# EAGLE schematic TempPCB_v18 (EAGLE 9.7.0)
COMPANY: ADAFRUIT INDUSTRIES; DRAWN: KTOWN; REV: A
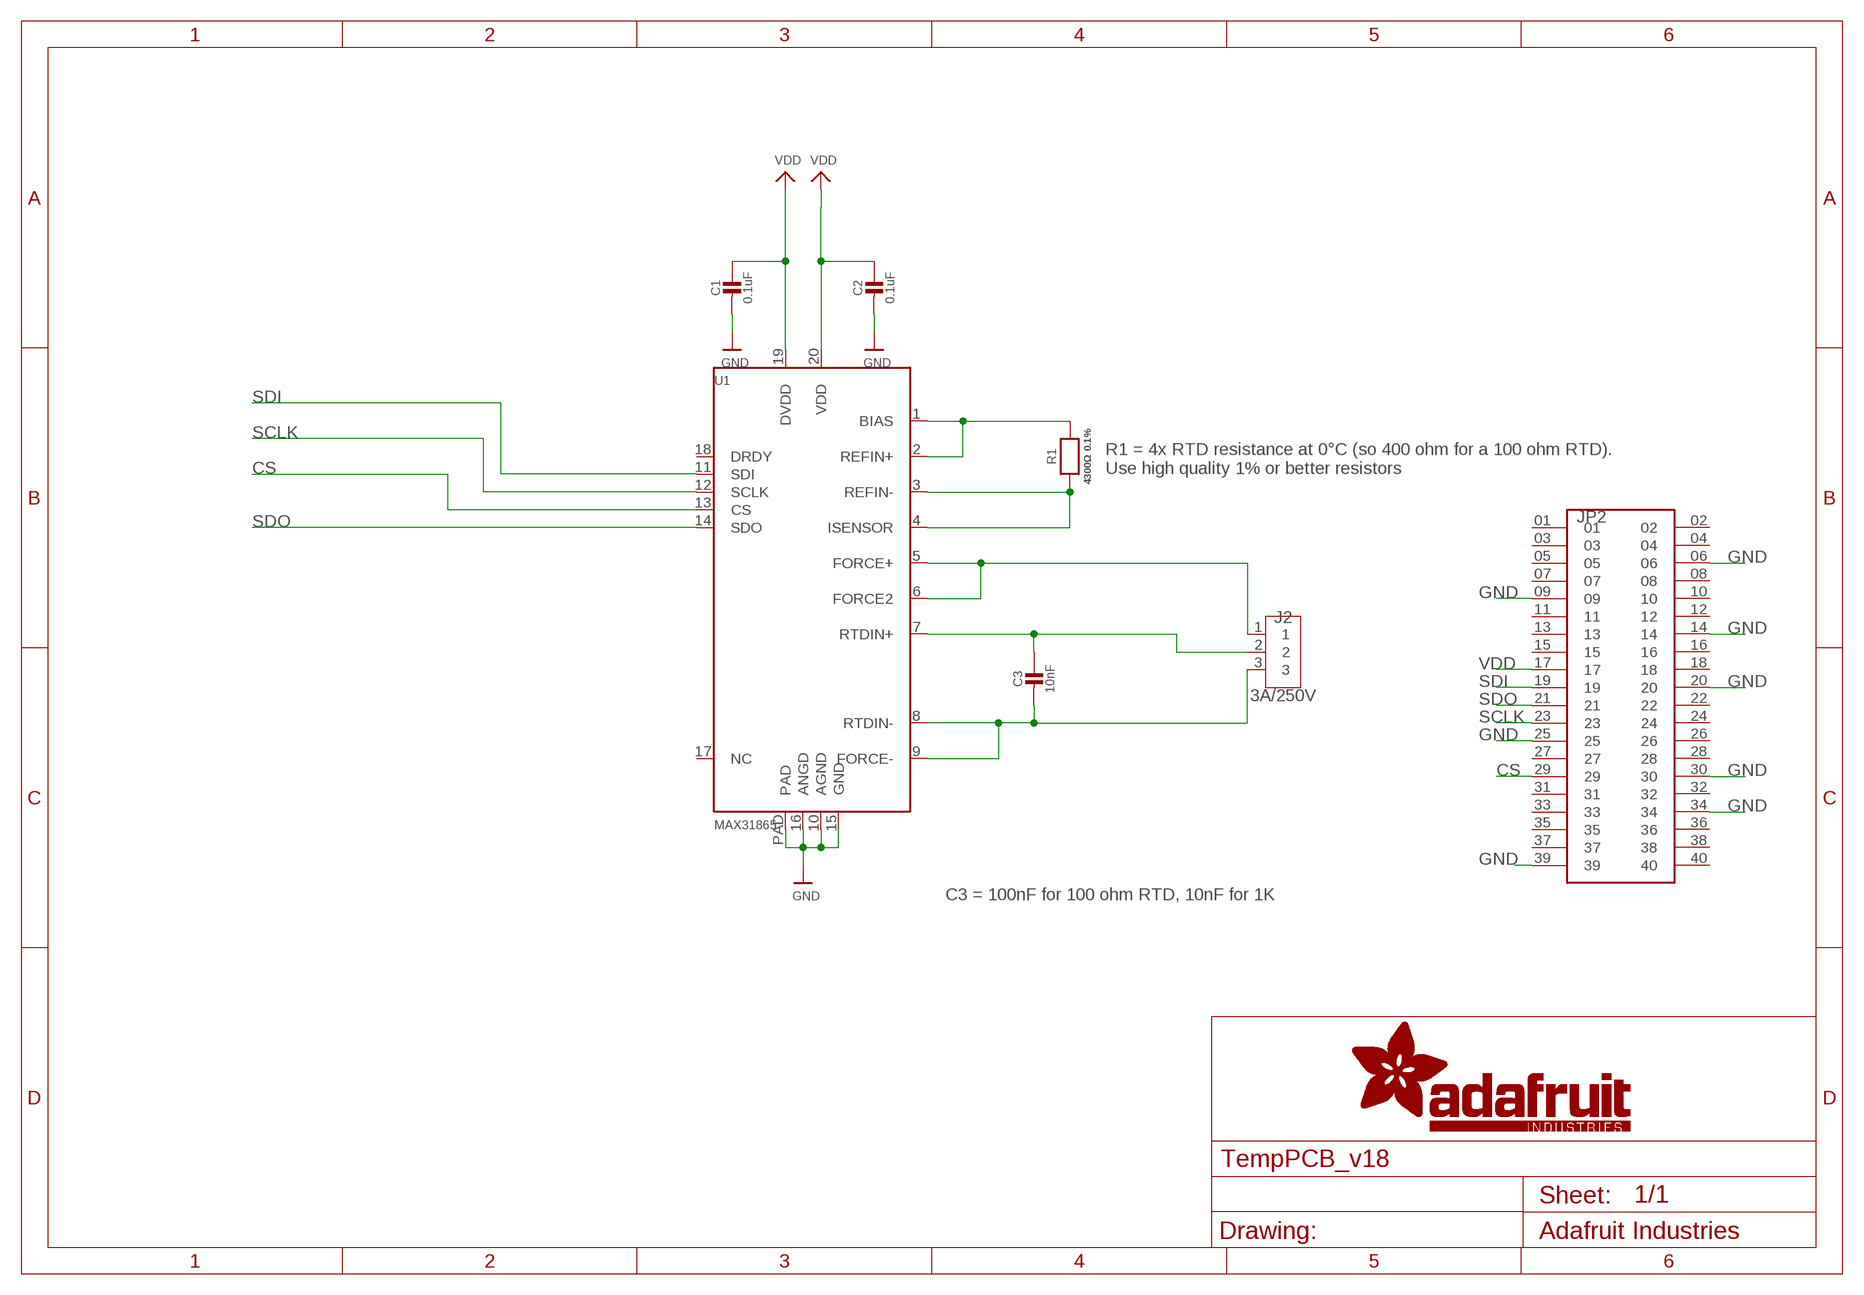
[diagram p0: schematic, sheet 1]

## Parts
C1  0.1uF  CAP_CERAMIC0805-NOOUTLINE  [0805-NO]
C2  0.1uF  CAP_CERAMIC0805-NOOUTLINE  [0805-NO]
C3  10nF  CAP_CERAMIC0805-NOOUTLINE  [0805-NO]
J2  3A/250V  S3B-XH-A  [S3B-XH-A]
JP2  SSQ-120-03-T-D  [SAMTEC_SSQ-120-03-T-D]
R1  4300Ω 0.1%  RESISTOR0805_NOOUTLINE  [0805-NO]
U1  MAX31865  TEMP_MAX31865  [QFN20_4MM_0.65MM]

## Nets
CS: JP2.29 U1.13(CS)
FORCE+: J2.1 U1.5(FORCE+) U1.6(FORCE2)
GND: C1.2 C2.2 JP2.06 JP2.09 JP2.14 JP2.20 JP2.25 JP2.30 JP2.34 JP2.39 U1.10(AGND) U1.15(GND) U1.16(ANGD) U1.PAD
N$1: R1.1 U1.3(REFIN-) U1.4(ISENSOR)
N$2: R1.2 U1.1(BIAS) U1.2(REFIN+)
RTDIN+: C3.1 J2.2 U1.7(RTDIN+)
RTDIN-: C3.2 J2.3 U1.8(RTDIN-) U1.9(FORCE-)
SCLK: JP2.23 U1.12(SCLK)
SDI: JP2.19 U1.11(SDI)
SDO: JP2.21 U1.14(SDO)
VDD: C1.1 C2.1 JP2.17 U1.19(DVDD) U1.20(VDD)
Unconnected: JP2.01 JP2.02 JP2.03 JP2.04 JP2.05 JP2.07 JP2.08 JP2.10 JP2.11 JP2.12 JP2.13 JP2.15 JP2.16 JP2.18 JP2.22 JP2.24 JP2.26 JP2.27 JP2.28 JP2.31 JP2.32 JP2.33 JP2.35 JP2.36 JP2.37 JP2.38 JP2.40 U1.17(NC) U1.18(DRDY)

## Notes on the sheet
- R1 = 4x RTD resistance at 0°C (so 400 ohm for a 100 ohm RTD).
  Use high quality 1% or better resistors
- C3 = 100nF for 100 ohm RTD, 10nF for 1K

## Library data of the parts
C1-C3 = microbuilder:CAP_CERAMIC: Ceramic Capacitors For new designs, use the packages preceded by an '_' character since they are more reliable: The following footprints should be used on most boards: _0402 - Standard footprint for regular board layouts _0603 - Standard footprint for regular board layouts _0805 - Standard footprint for regular board layouts _1206 - Standard footprint for regular board layouts For extremely tight-pitch boards where space is at a premium, the following 'micro-pitch' footprints can be used (smaller pads, no silkscreen outline, etc.): _0402MP - Micro-pitch footprint for very dense/compact boards _0603MP - Micro-pitch footprint for very dense/compact boards _0805MP - Micro-pitch footprint for very dense/compact boards _1206MP - Micro-pitch footprint for very dense/compact boards
J2 = Library:S3B-XH-A; CATEGORY: Header; DESCRIPTION: Connector Header Through Hole, Right Angle 3 position 0.098" (2.50mm); MANUFACTURER: JST Sales America Inc.; MPN: S3B-XH-A(LF)(SN); OPERATING_TEMPERATURE: -25°C ~ 85°C; PART_STATUS: Active; PITCH: 0.098" (2.50mm); ROHS_COMPLIANCE: ROHS3 Compliant; SERIES: XH; SUBCATEGORY: Rectangular Connectors; TYPE: Header, Male Pin, Board to Cable/Wire, Through Hole
JP2 = SnapEDA Library:SSQ-120-03-T-D; MANUFACTURER: Samtec Inc.; PARTREV: R; STANDARD: Manufacturer Recommendations
R1 = microbuilder:RESISTOR: Resistors For new designs, use the packages preceded by an '_' character since they are more reliable: The following footprints should be used on most boards: _0402 - Standard footprint for regular board layouts _0603 - Standard footprint for regular board layouts _0805 - Standard footprint for regular board layouts _1206 - Standard footprint for regular board layouts For extremely tight-pitch boards where space is at a premium, the following 'micro-pitch' footprints can be used (smaller pads, no silkscreen outline, etc.): _0402MP - Micro-pitch footprint for very dense/compact boards _0603MP - Micro-pitch footprint for very dense/compact boards _0805MP - Micro-pitch footprint for very dense/compact boards _1206MP - Micro-pitch footprint for very dense/compact boards
U1 = microbuilder:TEMP_MAX31865: MAX31865 - Resistance to Digital Convertor for Platinum Resistance Temperature Detectors (RTDs) Handles 100 ohm - 1K ohm (at 0°C) platinum RTDs. 15-bit ADC resolution (nominally 0.03125°C), 0.5°C accuracy.